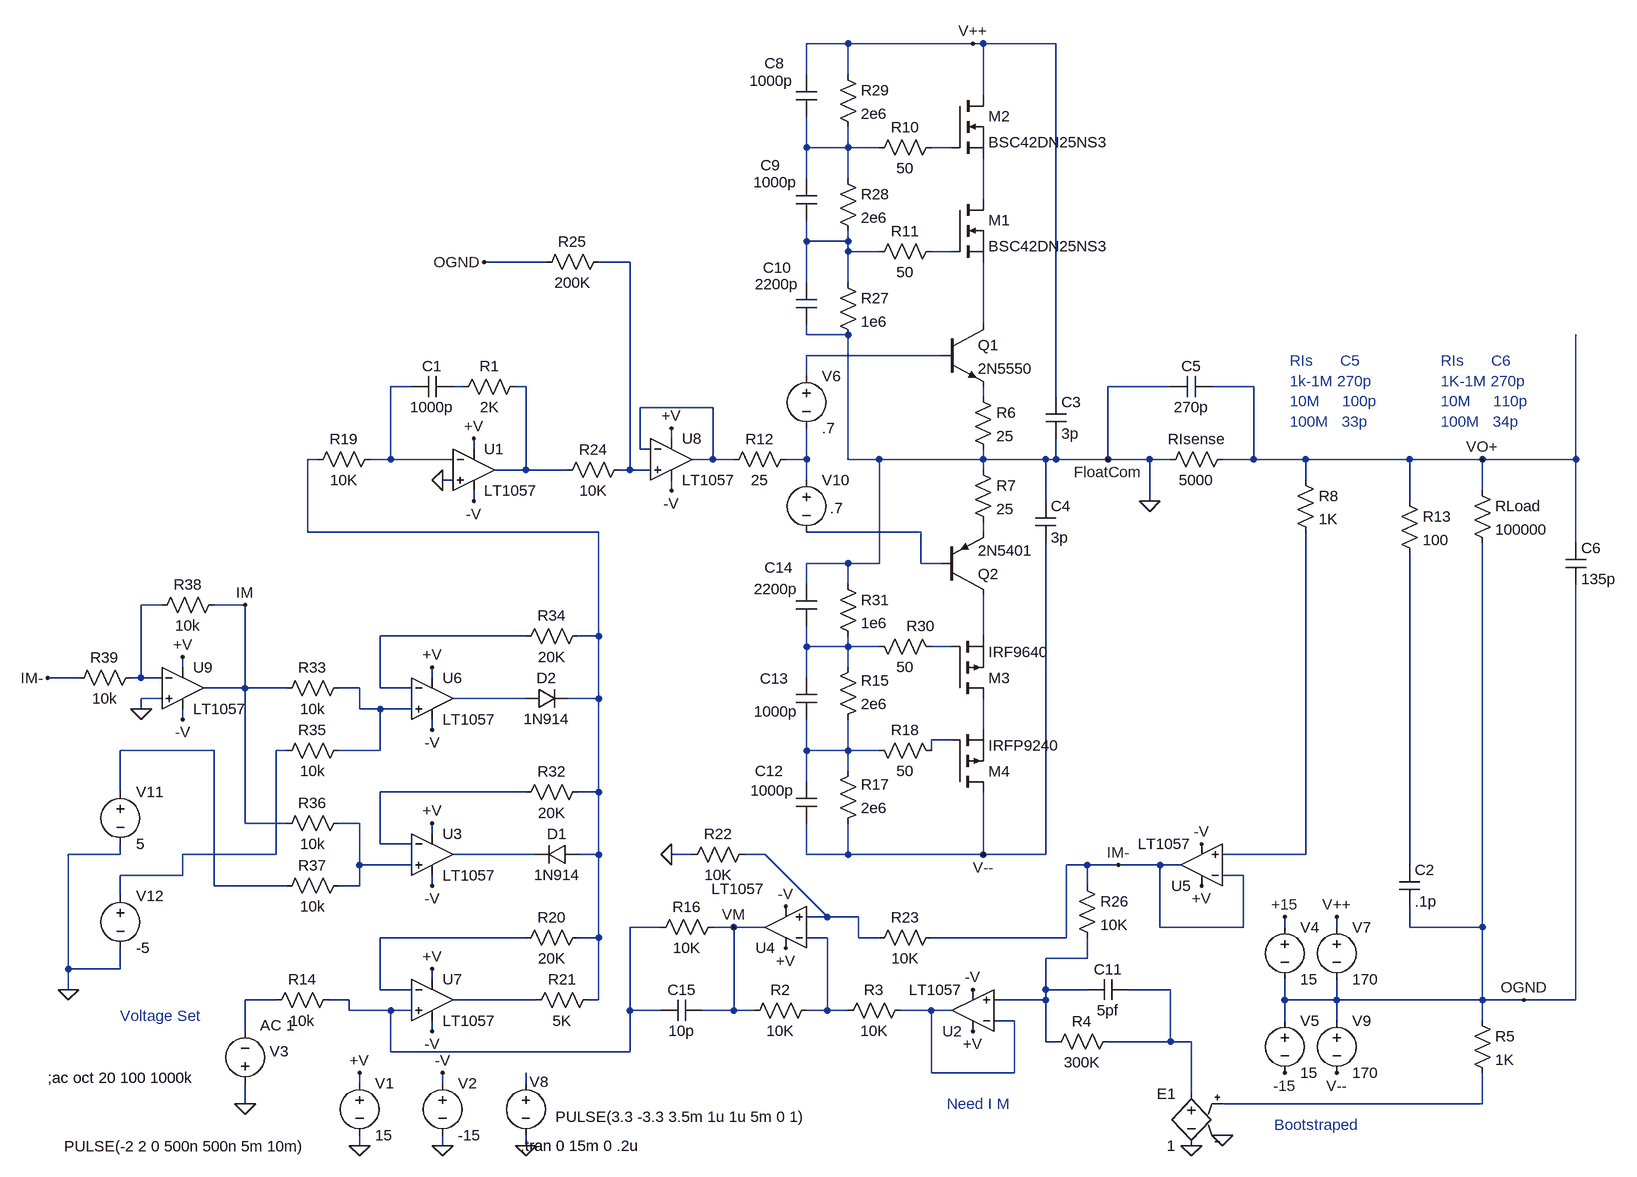
[diagram p0: schematic Sourcemeter Full FV.asc]
Sourcemeter Full FV.asc, the LTspice schematic file:
Version 4
SHEET 1 3040 692
WIRE 1488 -1024 1424 -1024
WIRE 1680 -1024 1488 -1024
WIRE 1696 -1024 1680 -1024
WIRE 1808 -1024 1696 -1024
WIRE 1424 -976 1424 -1024
WIRE 1488 -976 1488 -1024
WIRE 1696 -944 1696 -1024
WIRE 1424 -864 1424 -912
WIRE 1488 -864 1488 -896
WIRE 1488 -864 1424 -864
WIRE 1536 -864 1488 -864
WIRE 1648 -864 1616 -864
WIRE 1424 -816 1424 -864
WIRE 1488 -816 1488 -864
WIRE 1696 -784 1696 -848
WIRE 1424 -720 1424 -752
WIRE 1488 -720 1488 -736
WIRE 1488 -720 1424 -720
WIRE 1488 -704 1488 -720
WIRE 1536 -704 1488 -704
WIRE 1648 -704 1616 -704
WIRE 1024 -688 928 -688
WIRE 1152 -688 1104 -688
WIRE 1424 -656 1424 -720
WIRE 1488 -656 1488 -704
WIRE 1696 -592 1696 -688
WIRE 1424 -576 1424 -592
WIRE 1488 -576 1424 -576
WIRE 1632 -544 1424 -544
WIRE 1424 -512 1424 -544
WIRE 816 -496 784 -496
WIRE 896 -496 880 -496
WIRE 992 -496 976 -496
WIRE 1984 -496 1888 -496
WIRE 2112 -496 2048 -496
WIRE 1696 -480 1696 -496
WIRE 1808 -480 1808 -1024
WIRE 1280 -464 1168 -464
WIRE 1216 -416 1216 -432
WIRE 912 -400 912 -416
WIRE 1168 -400 1168 -464
WIRE 1184 -400 1168 -400
WIRE 672 -384 656 -384
WIRE 784 -384 784 -496
WIRE 784 -384 752 -384
WIRE 880 -384 784 -384
WIRE 1280 -384 1280 -464
WIRE 1280 -384 1248 -384
WIRE 1312 -384 1280 -384
WIRE 1424 -384 1424 -432
WIRE 1424 -384 1392 -384
WIRE 1488 -384 1488 -576
WIRE 1536 -384 1488 -384
WIRE 1696 -384 1696 -400
WIRE 1696 -384 1536 -384
WIRE 1792 -384 1696 -384
WIRE 1808 -384 1808 -416
WIRE 1808 -384 1792 -384
WIRE 1888 -384 1888 -496
WIRE 1888 -384 1808 -384
WIRE 1952 -384 1888 -384
WIRE 1984 -384 1952 -384
WIRE 2112 -384 2112 -496
WIRE 2112 -384 2064 -384
WIRE 2192 -384 2112 -384
WIRE 2352 -384 2192 -384
WIRE 2464 -384 2352 -384
WIRE 2608 -384 2608 -576
WIRE 2608 -384 2464 -384
WIRE 992 -368 992 -496
WIRE 992 -368 944 -368
WIRE 1056 -368 992 -368
WIRE 1152 -368 1152 -688
WIRE 1152 -368 1136 -368
WIRE 1184 -368 1152 -368
WIRE 1696 -368 1696 -384
WIRE 880 -352 864 -352
WIRE 1424 -352 1424 -384
WIRE 2192 -352 2192 -384
WIRE 1216 -336 1216 -352
WIRE 2464 -336 2464 -384
WIRE 912 -320 912 -336
WIRE 1792 -320 1792 -384
WIRE 1952 -320 1952 -384
WIRE 2352 -320 2352 -384
WIRE 656 -272 656 -384
WIRE 1104 -272 656 -272
WIRE 1600 -272 1424 -272
WIRE 1696 -272 1696 -288
WIRE 2608 -256 2608 -384
WIRE 1488 -224 1424 -224
WIRE 1536 -224 1536 -384
WIRE 1536 -224 1488 -224
WIRE 1600 -224 1600 -272
WIRE 1632 -224 1600 -224
WIRE 1424 -192 1424 -224
WIRE 1488 -192 1488 -224
WIRE 432 -160 400 -160
WIRE 560 -160 512 -160
WIRE 992 -112 768 -112
WIRE 1104 -112 1104 -272
WIRE 1104 -112 1072 -112
WIRE 1696 -112 1696 -176
WIRE 1424 -96 1424 -128
WIRE 1488 -96 1488 -112
WIRE 1488 -96 1424 -96
WIRE 1536 -96 1488 -96
WIRE 1648 -96 1616 -96
WIRE 464 -64 464 -80
WIRE 1488 -64 1488 -96
WIRE 304 -48 256 -48
WIRE 400 -48 400 -160
WIRE 400 -48 384 -48
WIRE 432 -48 400 -48
WIRE 848 -48 848 -64
WIRE 1424 -48 1424 -96
WIRE 560 -32 560 -160
WIRE 560 -32 496 -32
WIRE 624 -32 560 -32
WIRE 736 -32 704 -32
WIRE 768 -32 768 -112
WIRE 816 -32 768 -32
WIRE 432 -16 400 -16
WIRE 992 -16 880 -16
WIRE 1104 -16 1104 -112
WIRE 1104 -16 1056 -16
WIRE 400 0 400 -16
WIRE 736 0 736 -32
WIRE 768 0 736 0
WIRE 816 0 768 0
WIRE 464 16 464 0
WIRE 848 32 848 16
WIRE 1696 32 1696 -16
WIRE 1648 48 1616 48
WIRE 512 64 368 64
WIRE 624 64 608 64
WIRE 768 64 768 0
WIRE 768 64 704 64
WIRE 1424 64 1424 16
WIRE 1488 64 1488 16
WIRE 1488 64 1424 64
WIRE 1536 64 1488 64
WIRE 1616 64 1616 48
WIRE 1488 96 1488 64
WIRE 1424 112 1424 64
WIRE 368 128 368 64
WIRE 992 128 768 128
WIRE 1104 128 1104 -16
WIRE 1104 128 1072 128
WIRE 560 176 560 -32
WIRE 624 176 560 176
WIRE 736 176 704 176
WIRE 848 192 848 176
WIRE 768 208 768 128
WIRE 816 208 768 208
WIRE 368 224 368 208
WIRE 368 224 288 224
WIRE 608 224 608 64
WIRE 608 224 464 224
WIRE 1008 224 880 224
WIRE 1104 224 1104 128
WIRE 1104 224 1072 224
WIRE 1248 224 1216 224
WIRE 1360 224 1328 224
WIRE 1424 224 1424 176
WIRE 1488 224 1488 176
WIRE 1488 224 1424 224
WIRE 1696 224 1696 128
WIRE 1696 224 1488 224
WIRE 1792 224 1792 -256
WIRE 1792 224 1696 224
WIRE 2192 224 2192 -272
WIRE 2192 224 2064 224
WIRE 736 240 736 176
WIRE 816 240 736 240
WIRE 1856 240 1824 240
WIRE 1904 240 1856 240
WIRE 1968 240 1904 240
WIRE 2000 240 1968 240
WIRE 2352 240 2352 -240
WIRE 464 256 464 224
WIRE 464 256 368 256
WIRE 2096 256 2064 256
WIRE 512 272 512 64
WIRE 624 272 512 272
WIRE 736 272 736 240
WIRE 736 272 704 272
WIRE 848 272 848 256
WIRE 1856 272 1856 240
WIRE 368 288 368 256
WIRE 1456 320 1360 224
WIRE 1456 320 1424 320
WIRE 1504 320 1456 320
WIRE 1200 336 1152 336
WIRE 1312 336 1280 336
WIRE 1360 336 1312 336
WIRE 1968 336 1968 240
WIRE 2096 336 2096 256
WIRE 2096 336 1968 336
WIRE 2160 336 2160 320
WIRE 2240 336 2240 320
WIRE 2352 336 2352 304
WIRE 2464 336 2464 -256
WIRE 2464 336 2352 336
WIRE 992 352 768 352
WIRE 1104 352 1104 224
WIRE 1104 352 1072 352
WIRE 1456 352 1424 352
WIRE 1504 352 1504 320
WIRE 1536 352 1504 352
WIRE 1824 352 1824 240
WIRE 1824 352 1616 352
WIRE 1856 384 1856 352
WIRE 1856 384 1792 384
WIRE 288 400 288 224
WIRE 368 400 368 368
WIRE 368 400 288 400
WIRE 848 416 848 400
WIRE 288 432 288 400
WIRE 768 432 768 352
WIRE 816 432 768 432
WIRE 1792 432 1792 384
WIRE 1856 432 1792 432
WIRE 1984 432 1920 432
WIRE 608 448 560 448
WIRE 720 448 688 448
WIRE 1008 448 880 448
WIRE 1104 448 1104 352
WIRE 1104 448 1088 448
WIRE 1792 448 1792 432
WIRE 1792 448 1712 448
WIRE 2160 448 2160 416
WIRE 2240 448 2240 416
WIRE 2240 448 2160 448
WIRE 2464 448 2464 336
WIRE 2464 448 2240 448
WIRE 2528 448 2464 448
WIRE 2608 448 2608 -192
WIRE 2608 448 2528 448
WIRE 720 464 720 448
WIRE 784 464 720 464
WIRE 816 464 784 464
WIRE 1152 464 1152 336
WIRE 1200 464 1152 464
WIRE 1312 464 1312 336
WIRE 1312 464 1264 464
WIRE 1344 464 1312 464
WIRE 1456 464 1456 352
WIRE 1456 464 1424 464
WIRE 1488 464 1456 464
WIRE 1616 464 1568 464
WIRE 1648 464 1616 464
WIRE 1744 480 1712 480
WIRE 2160 480 2160 448
WIRE 2240 480 2240 448
WIRE 2464 480 2464 448
WIRE 560 496 560 448
WIRE 848 496 848 480
WIRE 1792 512 1792 448
WIRE 1808 512 1792 512
WIRE 1984 512 1984 432
WIRE 1984 512 1888 512
WIRE 2016 512 1984 512
WIRE 784 528 784 464
WIRE 1152 528 1152 464
WIRE 1152 528 784 528
WIRE 1616 560 1616 464
WIRE 1744 560 1744 480
WIRE 1744 560 1616 560
WIRE 736 576 736 560
WIRE 864 576 864 560
WIRE 992 576 992 560
WIRE 2016 592 2016 512
WIRE 560 608 560 576
WIRE 2464 608 2464 560
WIRE 2464 608 2064 608
WIRE 736 672 736 656
WIRE 864 672 864 656
WIRE 992 672 992 656
FLAG 736 672 0
FLAG 912 -416 +V
FLAG 736 560 +V
FLAG 560 608 0
FLAG 864 672 0
FLAG 864 560 -V
FLAG 912 -320 -V
FLAG 2240 320 V++
FLAG 992 672 0
FLAG 2240 560 V--
FLAG 1696 224 V--
FLAG 1680 496 +V
FLAG 1680 432 -V
FLAG 864 -352 0
FLAG 2160 320 +15
FLAG 2160 560 -15
FLAG 1392 368 +V
FLAG 1392 304 -V
FLAG 2032 272 +V
FLAG 2032 208 -V
FLAG 2064 656 0
FLAG 2016 672 0
FLAG 1888 -384 FloatCom
FLAG 2464 -384 VO+
FLAG 1952 -320 0
FLAG 2528 448 OGND
FLAG 848 400 +V
FLAG 848 496 -V
FLAG 1312 336 VM
FLAG 1216 224 0
FLAG 1216 -432 +V
FLAG 1216 -336 -V
FLAG 928 -688 OGND
FLAG 1680 -1024 V++
FLAG 848 176 +V
FLAG 848 272 -V
FLAG 848 -64 +V
FLAG 848 32 -V
FLAG 1904 240 IM-
FLAG 464 -80 +V
FLAG 464 16 -V
FLAG 256 -48 IM-
FLAG 400 0 0
FLAG 560 -160 IM
FLAG 288 432 0
SYMBOL voltage 736 560 R0
WINDOW 39 24 125 Left 2
WINDOW 123 0 0 Left 2
SYMATTR InstName V1
SYMATTR Value 15
SYMBOL voltage 560 592 R180
WINDOW 3 -94 -81 Left 2
WINDOW 123 -76 105 Left 2
WINDOW 39 0 0 Left 2
WINDOW 0 -67 65 Left 2
SYMATTR Value PULSE(-2 2 0 500n 500n 5m 10m)
SYMATTR Value2 AC 1
SYMATTR InstName V3
SYMBOL voltage 864 560 R0
WINDOW 39 24 125 Left 2
WINDOW 123 0 0 Left 2
SYMATTR InstName V2
SYMATTR Value -15
SYMBOL res 2080 -400 R90
WINDOW 0 0 56 VBottom 2
WINDOW 3 32 56 VTop 2
SYMATTR InstName RIsense
SYMATTR Value 5000
SYMBOL res 2448 -352 R0
SYMATTR InstName RLoad
SYMATTR Value 100000
SYMBOL cap 2336 240 R0
SYMATTR InstName C2
SYMATTR Value .1p
SYMBOL res 2336 -336 R0
SYMATTR InstName R13
SYMATTR Value 100
SYMBOL voltage 2240 320 R0
WINDOW 39 24 125 Left 2
WINDOW 123 0 0 Left 2
SYMATTR InstName V7
SYMATTR Value 170
SYMBOL voltage 992 560 R0
WINDOW 3 46 68 Left 2
WINDOW 123 -94 29 Left 2
WINDOW 39 0 0 Left 2
WINDOW 0 6 14 Left 2
SYMATTR Value PULSE(3.3 -3.3 3.5m 1u 1u 5m 0 1)
SYMATTR InstName V8
SYMBOL voltage 2240 464 R0
WINDOW 39 24 125 Left 2
WINDOW 123 0 0 Left 2
SYMATTR InstName V9
SYMATTR Value 170
SYMBOL res 1408 -400 R90
WINDOW 0 0 56 VBottom 2
WINDOW 3 32 56 VTop 2
SYMATTR InstName R12
SYMATTR Value 25
SYMBOL Opamps\\LT1057 912 -432 R0
SYMATTR InstName U1
SYMBOL res 1840 256 R0
SYMATTR InstName R26
SYMATTR Value 10K
SYMBOL res 1296 320 R90
WINDOW 0 0 56 VBottom 2
WINDOW 3 32 56 VTop 2
SYMATTR InstName R16
SYMATTR Value 10K
SYMBOL res 704 432 R90
WINDOW 0 0 56 VBottom 2
WINDOW 3 32 56 VTop 2
SYMATTR InstName R14
SYMATTR Value 10k
SYMBOL npn 1632 -592 R0
SYMATTR InstName Q1
SYMATTR Value 2N5550
SYMBOL pnp 1632 -176 M180
SYMATTR InstName Q2
SYMATTR Value 2N5401
SYMBOL res 1904 496 R90
WINDOW 0 0 56 VBottom 2
WINDOW 3 32 56 VTop 2
SYMATTR InstName R4
SYMATTR Value 300K
SYMBOL cap 880 -512 R90
WINDOW 0 0 32 VBottom 2
WINDOW 3 32 32 VTop 2
SYMATTR InstName C1
SYMATTR Value 1000p
SYMBOL Opamps\\LT1057 1680 528 R180
SYMATTR InstName U2
SYMBOL voltage 2160 320 R0
WINDOW 39 24 125 Left 2
WINDOW 123 0 0 Left 2
SYMATTR InstName V4
SYMATTR Value 15
SYMBOL voltage 2160 464 R0
WINDOW 39 24 125 Left 2
WINDOW 123 0 0 Left 2
SYMATTR InstName V5
SYMATTR Value 15
SYMBOL Opamps\\LT1057 1392 400 R180
WINDOW 3 32 123 Left 2
SYMATTR InstName U4
SYMBOL res 1440 448 R90
WINDOW 0 0 56 VBottom 2
WINDOW 3 32 56 VTop 2
SYMATTR InstName R2
SYMATTR Value 10K
SYMBOL res 1584 448 R90
WINDOW 0 0 56 VBottom 2
WINDOW 3 32 56 VTop 2
SYMATTR InstName R3
SYMATTR Value 10K
SYMBOL res 2448 464 R0
SYMATTR InstName R5
SYMATTR Value 1K
SYMBOL cap 1792 -480 R0
SYMATTR InstName C3
SYMATTR Value 3p
SYMBOL cap 1776 -320 R0
SYMATTR InstName C4
SYMATTR Value 3p
SYMBOL res 1680 -496 R0
SYMATTR InstName R6
SYMATTR Value 25
SYMBOL res 1680 -384 R0
SYMATTR InstName R7
SYMATTR Value 25
SYMBOL cap 2048 -512 R90
WINDOW 0 0 32 VBottom 2
WINDOW 3 32 32 VTop 2
SYMATTR InstName C5
SYMATTR Value 270p
SYMBOL Opamps\\LT1057 2032 304 R180
SYMATTR InstName U5
SYMBOL res 2176 -368 R0
SYMATTR InstName R8
SYMATTR Value 1K
SYMBOL e 2016 576 M0
SYMATTR InstName E1
SYMATTR Value 1
SYMBOL cap 2592 -256 R0
SYMATTR InstName C6
SYMATTR Value 135p
SYMBOL res 992 -512 R90
WINDOW 0 0 56 VBottom 2
WINDOW 3 32 56 VTop 2
SYMATTR InstName R1
SYMATTR Value 2K
SYMBOL res 768 -400 R90
WINDOW 0 0 56 VBottom 2
WINDOW 3 32 56 VTop 2
SYMATTR InstName R19
SYMATTR Value 10K
SYMBOL res 1088 336 R90
WINDOW 0 0 56 VBottom 2
WINDOW 3 32 56 VTop 2
SYMATTR InstName R20
SYMATTR Value 20K
SYMBOL Opamps\\LT1057 848 384 R0
SYMATTR InstName U7
SYMBOL res 1104 432 R90
WINDOW 0 0 56 VBottom 2
WINDOW 3 32 56 VTop 2
SYMATTR InstName R21
SYMATTR Value 5K
SYMBOL res 1344 208 R90
WINDOW 0 0 56 VBottom 2
WINDOW 3 32 56 VTop 2
SYMATTR InstName R22
SYMATTR Value 10K
SYMBOL res 1632 336 R90
WINDOW 0 0 56 VBottom 2
WINDOW 3 32 56 VTop 2
SYMATTR InstName R23
SYMATTR Value 10K
SYMBOL voltage 1424 -528 R0
WINDOW 39 24 125 Left 2
WINDOW 123 0 0 Left 2
SYMATTR InstName V6
SYMATTR Value .7
SYMBOL voltage 1424 -368 R0
WINDOW 39 24 125 Left 2
WINDOW 123 0 0 Left 2
WINDOW 3 36 59 Left 2
SYMATTR Value .7
SYMATTR InstName V10
SYMBOL Opamps\\LT1057 1216 -448 R0
SYMATTR InstName U8
SYMBOL res 1152 -384 R90
WINDOW 0 0 56 VBottom 2
WINDOW 3 32 56 VTop 2
SYMATTR InstName R24
SYMATTR Value 10K
SYMBOL res 1008 -672 R270
WINDOW 0 32 56 VTop 2
WINDOW 3 0 56 VBottom 2
SYMATTR InstName R25
SYMATTR Value 200K
SYMBOL nmos 1648 -784 R0
SYMATTR InstName M1
SYMATTR Value BSC42DN25NS3
SYMBOL res 1472 -672 R0
SYMATTR InstName R27
SYMATTR Value 1e6
SYMBOL res 1472 -832 R0
SYMATTR InstName R28
SYMATTR Value 2e6
SYMBOL res 1472 -992 R0
SYMATTR InstName R29
SYMATTR Value 2e6
SYMBOL cap 1408 -976 R0
WINDOW 3 -72 9 Left 2
WINDOW 0 -49 -18 Left 2
SYMATTR Value 1000p
SYMATTR InstName C8
SYMBOL cap 1408 -816 R0
WINDOW 3 -66 5 Left 2
WINDOW 0 -55 -21 Left 2
SYMATTR Value 1000p
SYMATTR InstName C9
SYMBOL cap 1408 -656 R0
WINDOW 3 -63 2 Left 2
WINDOW 0 -51 -23 Left 2
SYMATTR Value 2200p
SYMATTR InstName C10
SYMBOL cap 1920 416 R90
WINDOW 0 0 32 VBottom 2
WINDOW 3 32 32 VTop 2
SYMATTR InstName C11
SYMATTR Value 5pf
SYMBOL nmos 1648 -944 R0
SYMATTR InstName M2
SYMATTR Value BSC42DN25NS3
SYMBOL res 1632 -880 R90
WINDOW 0 0 56 VBottom 2
WINDOW 3 32 56 VTop 2
SYMATTR InstName R10
SYMATTR Value 50
SYMBOL res 1632 -720 R90
WINDOW 0 0 56 VBottom 2
WINDOW 3 32 56 VTop 2
SYMATTR InstName R11
SYMATTR Value 50
SYMBOL pmos 1648 -16 M180
SYMATTR InstName M3
SYMATTR Value IRF9640
SYMBOL pmos 1648 128 M180
SYMATTR InstName M4
SYMATTR Value IRFP9240
SYMBOL res 1472 32 M180
WINDOW 0 36 76 Left 2
WINDOW 3 36 40 Left 2
SYMATTR InstName R15
SYMATTR Value 2e6
SYMBOL res 1472 192 M180
WINDOW 0 36 76 Left 2
WINDOW 3 36 40 Left 2
SYMATTR InstName R17
SYMATTR Value 2e6
SYMBOL cap 1408 176 M180
WINDOW 3 -70 51 Left 2
WINDOW 0 -63 81 Left 2
SYMATTR Value 1000p
SYMATTR InstName C12
SYMBOL cap 1408 16 M180
WINDOW 3 -65 12 Left 2
WINDOW 0 -56 63 Left 2
SYMATTR Value 1000p
SYMATTR InstName C13
SYMBOL res 1632 80 M270
WINDOW 0 32 56 VTop 2
WINDOW 3 0 56 VBottom 2
SYMATTR InstName R18
SYMATTR Value 50
SYMBOL res 1632 -80 M270
WINDOW 0 32 32 VTop 2
WINDOW 3 0 56 VBottom 2
SYMATTR InstName R30
SYMATTR Value 50
SYMBOL res 1472 -208 R0
SYMATTR InstName R31
SYMATTR Value 1e6
SYMBOL cap 1408 -192 R0
WINDOW 3 -65 7 Left 2
WINDOW 0 -49 -26 Left 2
SYMATTR Value 2200p
SYMATTR InstName C14
SYMBOL cap 1264 448 R90
WINDOW 0 0 32 VBottom 2
WINDOW 3 32 32 VTop 2
SYMATTR InstName C15
SYMATTR Value 10p
SYMBOL res 1088 112 R90
WINDOW 0 0 56 VBottom 2
WINDOW 3 32 56 VTop 2
SYMATTR InstName R32
SYMATTR Value 20K
SYMBOL Opamps\\LT1057 848 160 R0
SYMATTR InstName U3
SYMBOL res 1088 -128 R90
WINDOW 0 0 56 VBottom 2
WINDOW 3 32 56 VTop 2
SYMATTR InstName R34
SYMATTR Value 20K
SYMBOL Opamps\\LT1057 848 -80 R0
SYMATTR InstName U6
SYMBOL diode 1072 208 R90
WINDOW 0 0 32 VBottom 2
WINDOW 3 32 32 VTop 2
SYMATTR InstName D1
SYMATTR Value 1N914
SYMBOL diode 992 0 R270
WINDOW 0 32 32 VTop 2
WINDOW 3 0 32 VBottom 2
SYMATTR InstName D2
SYMATTR Value 1N914
SYMBOL res 720 -48 R90
WINDOW 0 0 56 VBottom 2
WINDOW 3 32 56 VTop 2
SYMATTR InstName R33
SYMATTR Value 10k
SYMBOL res 720 48 R90
WINDOW 0 0 56 VBottom 2
WINDOW 3 32 56 VTop 2
SYMATTR InstName R35
SYMATTR Value 10k
SYMBOL res 720 160 R90
WINDOW 0 0 56 VBottom 2
WINDOW 3 32 56 VTop 2
SYMATTR InstName R36
SYMATTR Value 10k
SYMBOL res 720 256 R90
WINDOW 0 0 56 VBottom 2
WINDOW 3 32 56 VTop 2
SYMATTR InstName R37
SYMATTR Value 10k
SYMBOL Opamps\\LT1057 464 -96 R0
SYMATTR InstName U9
SYMBOL res 528 -176 R90
WINDOW 0 0 56 VBottom 2
WINDOW 3 32 56 VTop 2
SYMATTR InstName R38
SYMATTR Value 10k
SYMBOL res 400 -64 R90
WINDOW 0 0 56 VBottom 2
WINDOW 3 32 56 VTop 2
SYMATTR InstName R39
SYMATTR Value 10k
SYMBOL voltage 368 112 R0
WINDOW 39 24 125 Left 2
WINDOW 123 0 0 Left 2
SYMATTR InstName V11
SYMATTR Value 5
SYMBOL voltage 368 272 R0
WINDOW 39 24 125 Left 2
WINDOW 123 0 0 Left 2
SYMATTR InstName V12
SYMATTR Value -5
TEXT 984 672 Left 2 !.tran 0 15m 0 .2u
TEXT 256 568 Left 2 !;ac oct 20 100 1000k
TEXT 368 472 Left 2 ;Voltage Set
TEXT 2144 640 Left 2 ;Bootstraped
TEXT 2400 -536 Left 2 ;RIs      C6\n1K-1M 270p\n10M     110p\n100M   34p
TEXT 2168 -536 Left 2 ;RIs      C5\n1k-1M 270p\n10M     100p\n100M   33p
TEXT 1640 608 Left 2 ;Need I M

The netlist it stands for:
* Sourcemeter Full FV.asc
V1 +V 0 15
V3 0 N041 PULSE(-2 2 0 500n 500n 5m 10m) AC 1
V2 -V 0 -15
RIsense VO+ 0 5000
RLoad VO+ OGND 100000
C2 N035 OGND .1p
R13 VO+ N035 100
V7 V++ OGND 170
V8 N044 0 PULSE(3.3 -3.3 3.5m 1u 1u 5m 0 1)
V9 OGND V-- 170
R12 N015 N013 25
XU1 0 N009 +V -V N011 LT1057  ; pins In+ In- V+ V- OUT
R26 IM- N039 10K
R16 VM N036 10K
R14 N036 N041 10k
Q1 N007 N008 N012 0 2N5550
Q2 N020 N016 N017 0 2N5401
R4 N040 N039 300K
C1 N010 N009 1000p
XU2 N039 N043 +V -V N043 LT1057  ; pins In+ In- V+ V- OUT
V4 +15 OGND 15
V5 OGND -15 15
XU4 N033 N038 +V -V VM LT1057  ; pins In+ In- V+ V- OUT
R2 N038 VM 10K
R3 N043 N038 10K
R5 OGND N045 1K
C3 V++ 0 3p
C4 0 V-- 3p
R6 N012 0 25
R7 0 N017 25
C5 VO+ 0 270p
XU5 N034 IM- +V -V IM- LT1057  ; pins In+ In- V+ V- OUT
R8 VO+ N034 1K
E1 N040 0 N045 0 1
C6 VO+ OGND 135p
R1 N011 N010 2K
R19 N009 N014 10K
R20 N014 N037 20K
XU7 N036 N037 +V -V N042 LT1057  ; pins In+ In- V+ V- OUT
R21 N014 N042 5K
R22 N033 0 10K
R23 IM- N033 10K
V6 N008 N015 .7
V10 N015 N016 .7
XU8 N006 N013 +V -V N013 LT1057  ; pins In+ In- V+ V- OUT
R24 N006 N011 10K
R25 OGND N006 200K
M1 N003 N005 N007 N007 BSC42DN25NS3
R27 N004 0 1e6
R28 N001 N004 2e6
R29 V++ N001 2e6
C8 V++ N001 1000p
C9 N001 N004 1000p
C10 N004 0 2200p
C11 N040 N039 5pf
M2 V++ N002 N003 N003 BSC42DN25NS3
R10 N002 N001 50
R11 N005 N004 50
M3 N025 N022 N020 N020 IRF9640
M4 V-- N026 N025 N025 IRFP9240
R15 N029 N021 2e6
R17 V-- N029 2e6
C12 V-- N029 1000p
C13 N029 N021 1000p
R18 N026 N029 50
R30 N022 N021 50
R31 0 N021 1e6
C14 0 N021 2200p
C15 VM N036 10p
R32 N014 N030 20K
XU3 N031 N030 +V -V N032 LT1057  ; pins In+ In- V+ V- OUT
R34 N014 N019 20K
XU6 N023 N019 +V -V N024 LT1057  ; pins In+ In- V+ V- OUT
D1 N014 N032 1N914
D2 N024 N014 1N914
R33 N023 IM 10k
R35 N023 N028 10k
R36 N031 IM 10k
R37 N031 N027 10k
XU9 0 N018 +V -V IM LT1057  ; pins In+ In- V+ V- OUT
R38 IM N018 10k
R39 N018 IM- 10k
V11 N027 0 5
V12 N028 0 -5
.model D D
.lib standard.dio
.model NPN NPN
.model PNP PNP
.lib standard.bjt
.model NMOS NMOS
.model PMOS PMOS
.lib standard.mos
.tran 0 15m 0 .2u
;ac oct 20 100 1000k
* Voltage Set
* Bootstraped
* RIs      C6
* 1K-1M 270p
* 10M     110p
* 100M   34p
* RIs      C5
* 1k-1M 270p
* 10M     100p
* 100M   33p
* Need I M
.lib LTC.lib
.backanno
.end